# EAGLE schematic sam9g25 (EAGLE 7.2.0)
SAM9G25 Embedded Linux Board Copyright (C) 2015 Andreas Auer (aauer1@emicrotec.at) This program is free software; you can redistribute it and/or modify it under the terms of the GNU General Public License as published by the Free Software Foundation; either version 2 of the License, or (at your option) any later version. This program is distributed in the hope that it will be useful, but WITHOUT ANY WARRANTY; without even the implied warranty of MERCHANTABILITY or FITNESS FOR A PARTICULAR PURPOSE. See the GNU General Public License for more details. You should have received a copy of the GNU General Public License along with this program; if not, write to the Free Software Foundation, Inc., 51 Franklin Street, Fifth Floor, Boston, MA 02110-1301 USA.

## Sheet 1 of 3
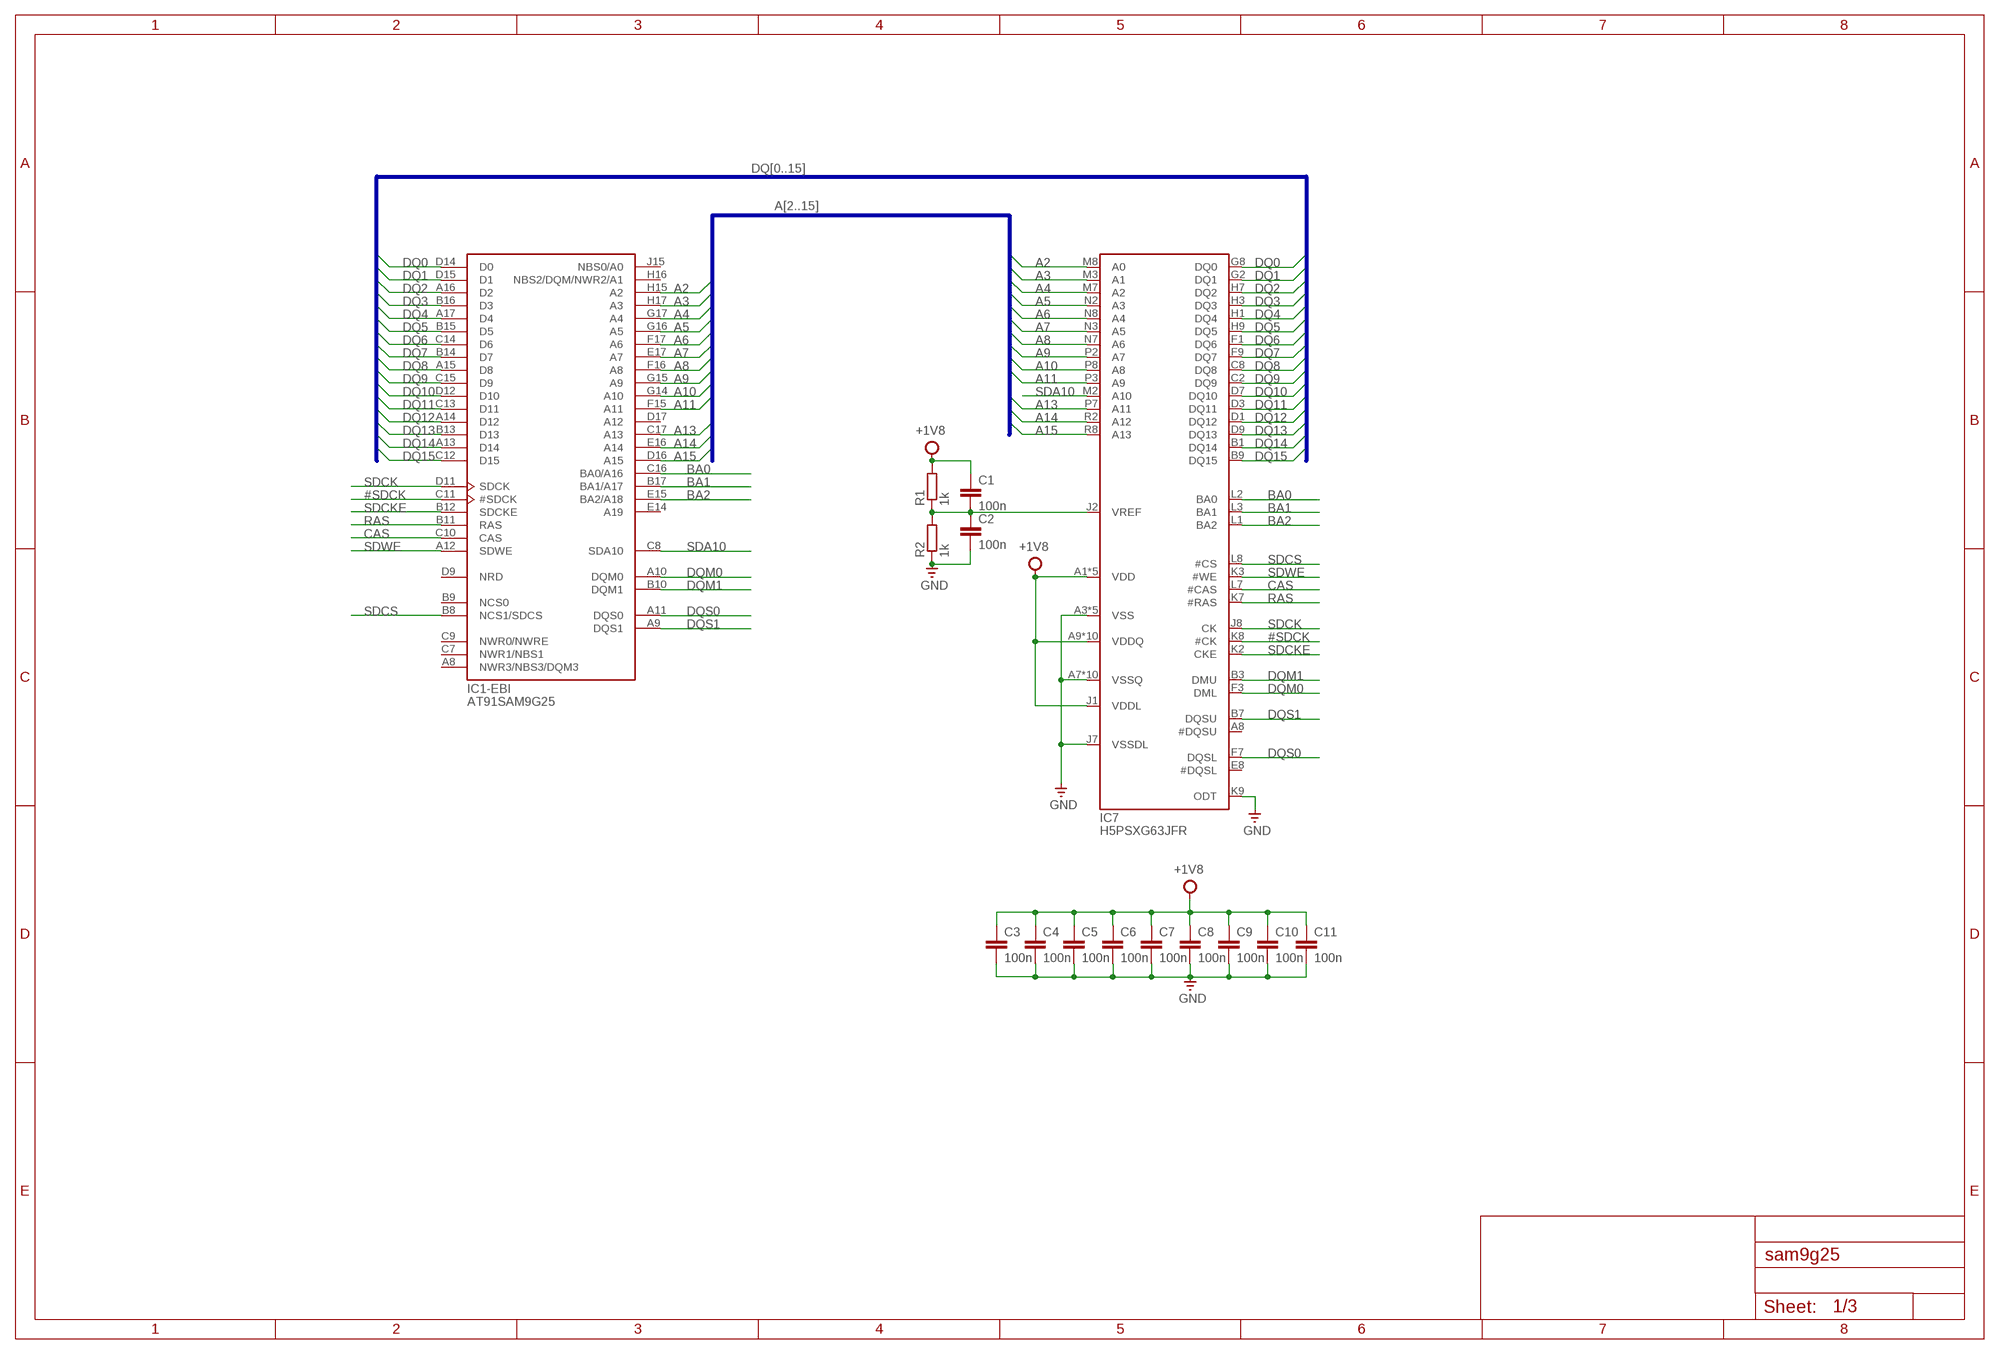
[diagram p0: schematic, sheet 1]

### Parts
C1  100n  C-EUC0603  [C0603]
C2  100n  C-EUC0603  [C0603]
C3  100n  C-EUC0603  [C0603]
C4  100n  C-EUC0603  [C0603]
C5  100n  C-EUC0603  [C0603]
C6  100n  C-EUC0603  [C0603]
C7  100n  C-EUC0603  [C0603]
C8  100n  C-EUC0603  [C0603]
C9  100n  C-EUC0603  [C0603]
C10  100n  C-EUC0603  [C0603]
C11  100n  C-EUC0603  [C0603]
IC1  AT91SAM9G25  [LFBGA217]
IC7  H5PSXG63JFR  [FBGA84]
R1  1k  R-EU_R0603  [R0603]
R2  1k  R-EU_R0603  [R0603]

### Nets
#SDCK: IC1.C11(-EBI:#SDCK) IC7.K8(#CK)
+1V8: C1.1 C3.1 C4.1 C5.1 C6.1 C7.1 C8.1 C9.1 C10.1 C11.1 IC7.A1(VDD) IC7.A9(VDDQ) IC7.C1(VDDQ) IC7.C3(VDDQ) IC7.C7(VDDQ) IC7.C9(VDDQ) IC7.E1(VDD) IC7.E9(VDDQ) IC7.G1(VDDQ) IC7.G3(VDDQ) IC7.G7(VDDQ) IC7.G9(VDDQ) IC7.J1(VDDL) IC7.J9(VDD) IC7.M9(VDD) IC7.R1(VDD) R1.2 ; also sheet 3
A2: IC1.H15(-EBI:A2) IC7.M8(A0)
A3: IC1.H17(-EBI:A3) IC7.M3(A1)
A4: IC1.G17(-EBI:A4) IC7.M7(A2)
A5: IC1.G16(-EBI:A5) IC7.N2(A3)
A6: IC1.F17(-EBI:A6) IC7.N8(A4)
A7: IC1.E17(-EBI:A7) IC7.N3(A5)
A8: IC1.F16(-EBI:A8) IC7.N7(A6)
A9: IC1.G15(-EBI:A9) IC7.P2(A7)
A10: IC1.G14(-EBI:A10) IC7.P8(A8)
A11: IC1.F15(-EBI:A11) IC7.P3(A9)
A13: IC1.C17(-EBI:A13) IC7.P7(A11)
A14: IC1.E16(-EBI:A14) IC7.R2(A12)
A15: IC1.D16(-EBI:A15) IC7.R8(A13)
BA0: IC1.C16(-EBI:BA0/A16) IC7.L2(BA0)
BA1: IC1.B17(-EBI:BA1/A17) IC7.L3(BA1)
BA2: IC1.E15(-EBI:BA2/A18) IC7.L1(BA2)
CAS: IC1.C10(-EBI:CAS) IC7.L7(#CAS)
DQ0: IC1.D14(-EBI:D0) IC7.G8(DQ0)
DQ1: IC1.D15(-EBI:D1) IC7.G2(DQ1)
DQ2: IC1.A16(-EBI:D2) IC7.H7(DQ2)
DQ3: IC1.B16(-EBI:D3) IC7.H3(DQ3)
DQ4: IC1.A17(-EBI:D4) IC7.H1(DQ4)
DQ5: IC1.B15(-EBI:D5) IC7.H9(DQ5)
DQ6: IC1.C14(-EBI:D6) IC7.F1(DQ6)
DQ7: IC1.B14(-EBI:D7) IC7.F9(DQ7)
DQ8: IC1.A15(-EBI:D8) IC7.C8(DQ8)
DQ9: IC1.C15(-EBI:D9) IC7.C2(DQ9)
DQ10: IC1.D12(-EBI:D10) IC7.D7(DQ10)
DQ11: IC1.C13(-EBI:D11) IC7.D3(DQ11)
DQ12: IC1.A14(-EBI:D12) IC7.D1(DQ12)
DQ13: IC1.B13(-EBI:D13) IC7.D9(DQ13)
DQ14: IC1.A13(-EBI:D14) IC7.B1(DQ14)
DQ15: IC1.C12(-EBI:D15) IC7.B9(DQ15)
DQM0: IC1.A10(-EBI:DQM0) IC7.F3(DML)
DQM1: IC1.B10(-EBI:DQM1) IC7.B3(DMU)
DQS0: IC1.A11(-EBI:DQS0) IC7.F7(DQSL)
DQS1: IC1.A9(-EBI:DQS1) IC7.B7(DQSU)
GND: C2.2 C3.2 C4.2 C5.2 C6.2 C7.2 C8.2 C9.2 C10.2 C11.2 IC7.A3(VSS) IC7.A7(VSSQ) IC7.B2(VSSQ) IC7.B8(VSSQ) IC7.D2(VSSQ) IC7.D8(VSSQ) IC7.E3(VSS) IC7.E7(VSSQ) IC7.F2(VSSQ) IC7.F8(VSSQ) IC7.H2(VSSQ) IC7.H8(VSSQ) IC7.J3(VSS) IC7.J7(VSSDL) IC7.K9(ODT) IC7.N1(VSS) IC7.P9(VSS) R2.1 ; also sheet 2,3
N$1: C1.2 C2.1 IC7.J2(VREF) R1.1 R2.2
RAS: IC1.B11(-EBI:RAS) IC7.K7(#RAS)
SDA10: IC1.C8(-EBI:SDA10) IC7.M2(A10)
SDCK: IC1.D11(-EBI:SDCK) IC7.J8(CK)
SDCKE: IC1.B12(-EBI:SDCKE) IC7.K2(CKE)
SDCS: IC1.B8(-EBI:NCS1/SDCS) IC7.L8(#CS)
SDWE: IC1.A12(-EBI:SDWE) IC7.K3(#WE)
Unconnected: IC1.A8(-EBI:NWR3/NBS3/DQM3) IC1.B9(-EBI:NCS0) IC1.C7(-EBI:NWR1/NBS1) IC1.C9(-EBI:NWR0/NWRE) IC1.D9(-EBI:NRD) IC1.D17(-EBI:A12) IC1.E14(-EBI:A19) IC1.H16(-EBI:NBS2/DQM/NWR2/A1) IC1.J15(-EBI:NBS0/A0) IC1.J16(-PORTD:PD21/D31/NCS5) IC1.J17(-PORTD:PD19/D29/NCS2) IC1.K15(-PORTD:PD12/D22) IC1.K16(-PORTD:PD20/D30/NCS4) IC1.K17(-PORTD:PD18/D28/A25) IC1.L14(-PORTD:PD14/D24) IC1.L15(-PORTD:PD17/D27/A24) IC1.L16(-PORTD:PD16/D26/A23) IC1.M14(-PORTD:PD8/D18) IC1.M15(-PORTD:PD13/D23) IC1.M16(-PORTD:PD15/D25/A20) IC1.N14(-PORTD:PD6/D16) IC1.N15(-PORTD:PD11/D21) IC1.N16(-PORTD:PD9/D19) IC1.N17(-PORTD:PD10/D20) IC1.P11(-SMD:DIBP) IC1.P12(-PORTD:PD4/NCS3) IC1.P13(-PORTD:PD0/NANDOE) IC1.P14(-PORTD:PD5/NWAIT) IC1.P15(-PORTD:PD3/A22/NANDCLE) IC1.R11(-SMD:DIBN) IC1.R13(-PORTD:PD2/A21/NANDALE) IC1.R14(-PORTD:PD1/NANDWE) IC1.R15(-PORTD:PD7/D17) IC7.A8(#DQSU) IC7.E8(#DQSL)

### Buses
DQ[0..15]
A[2..15]

## Sheet 2 of 3
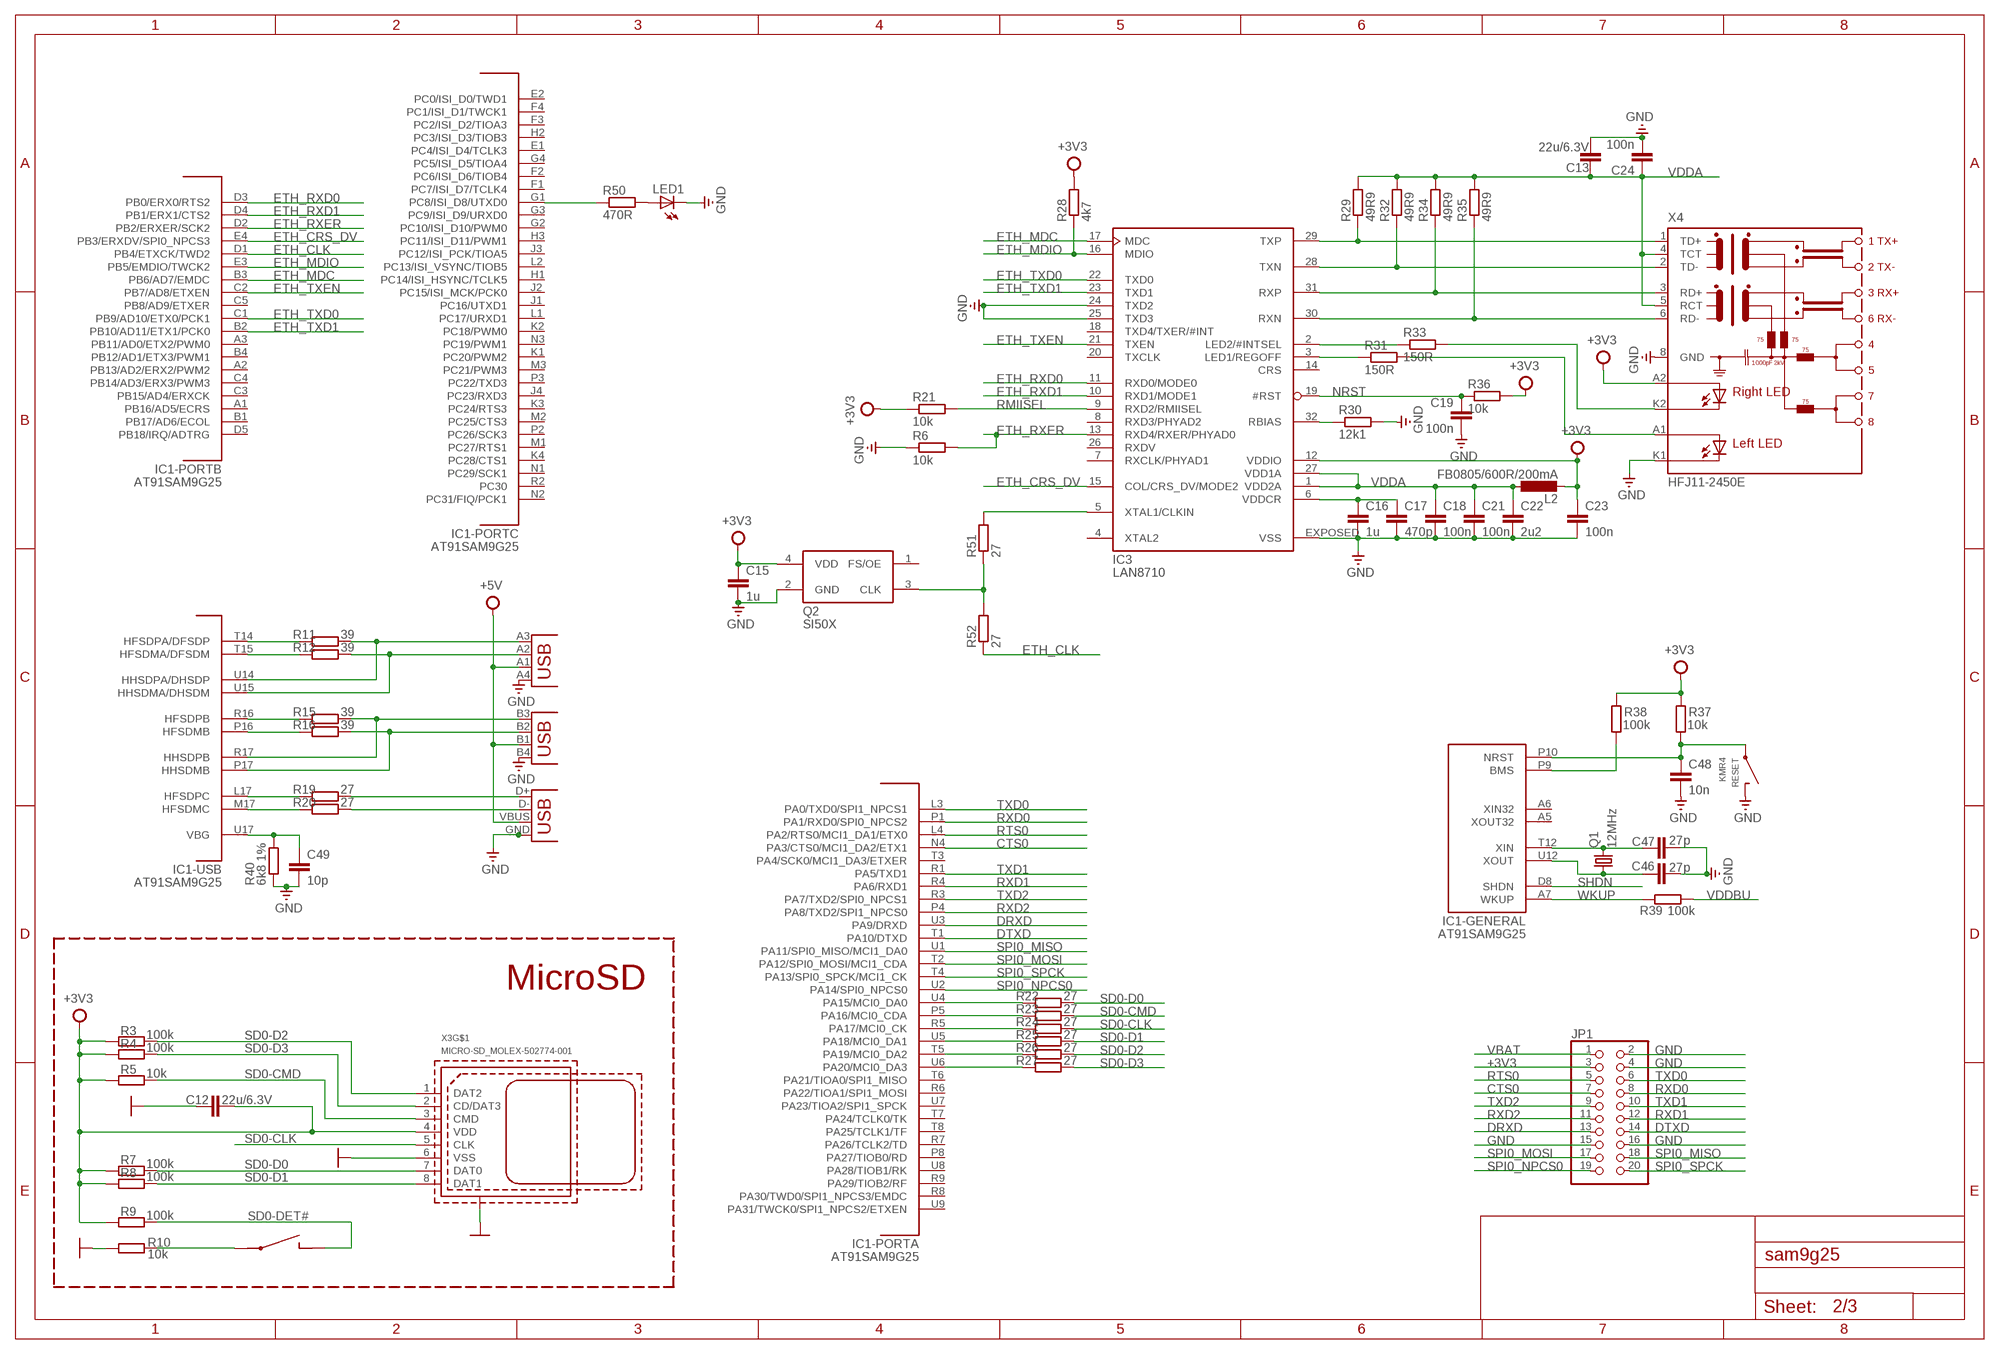
[diagram p1: schematic, sheet 2]

### Parts
C12  22u/6.3V  C-EUC0805  [C0805]
C13  22u/6.3V  C-EUC0805  [C0805]
C15  1u  C-EUC0603  [C0603]
C16  1u  C-EUC0603  [C0603]
C17  470p  C-EUC0603  [C0603]
C18  100n  C-EUC0603  [C0603]
C19  100n  C-EUC0603  [C0603]
C21  100n  C-EUC0603  [C0603]
C22  2u2  C-EUC0603  [C0603]
C23  100n  C-EUC0603  [C0603]
C24  100n  C-EUC0603  [C0603]
C46  27p  C-EUC0603  [C0603]
C47  27p  C-EUC0603  [C0603]
C48  10n  C-EUC0603  [C0603]
C49  10p  C-EUC0603  [C0603]
IC3  LAN8710  [QFN32]
JP1  PINHD-2X10  [2X10]
L2  FB0805/600R/200mA  L-EUL2012C  [L2012C]
LED1  LEDCHIP-LED0603  [CHIP-LED0603]
Q1  12MHz  CRYSTAL-5032  [SMD5032]
Q2  SI50X  [DFN4]
R3  100k  R-EU_R0603  [R0603]
R4  100k  R-EU_R0603  [R0603]
R5  10k  R-EU_R0603  [R0603]
R6  10k  R-EU_R0603  [R0603]
R7  100k  R-EU_R0603  [R0603]
R8  100k  R-EU_R0603  [R0603]
R9  100k  R-EU_R0603  [R0603]
R10  10k  R-EU_R0603  [R0603]
R11  39  R-EU_R0603  [R0603]
R12  39  R-EU_R0603  [R0603]
R15  39  R-EU_R0603  [R0603]
R16  39  R-EU_R0603  [R0603]
R19  27  R-EU_R0603  [R0603]
R20  27  R-EU_R0603  [R0603]
R21  10k  R-EU_R0603  [R0603]
R22  27  R-EU_R0603  [R0603]
R23  27  R-EU_R0603  [R0603]
R24  27  R-EU_R0603  [R0603]
R25  27  R-EU_R0603  [R0603]
R26  27  R-EU_R0603  [R0603]
R27  27  R-EU_R0603  [R0603]
R28  4k7  R-EU_R0603  [R0603]
R29  49R9  R-EU_R0603  [R0603]
R30  12k1  R-EU_R0603  [R0603]
R31  150R  R-EU_R0603  [R0603]
R32  49R9  R-EU_R0603  [R0603]
R33  150R  R-EU_R0603  [R0603]
R34  49R9  R-EU_R0603  [R0603]
R35  49R9  R-EU_R0603  [R0603]
R36  10k  R-EU_R0603  [R0603]
R37  10k  R-EU_R0603  [R0603]
R38  100k  R-EU_R0603  [R0603]
R39  100k  R-EU_R0603  [R0603]
R40  6k8 1%  R-EU_R0603  [R0603]
R50  470R  R-EU_R0603  [R0603]
R51  27  R-EU_R0603  [R0603]
R52  27  R-EU_R0603  [R0603]
RESET  KMR4  [KMR4]
X1  USB-DOUBLE  [USB-DOUBLE-FCI]
X3  MICRO-SD_MOLEX-502774-001  [MOLEX-MICRO-SD]
X4  HFJ11-2450E  [HFJ11_LED]
X5  USB-A-HU  [USB-A-HU]

### Nets
+3V3: C12.2 C15.1 C23.1 IC3.12(VDDIO) JP1.3 L2.2 Q2.4(VDD) R3.2 R4.2 R5.2 R7.2 R8.2 R9.2 R21.1 R28.2 R36.2 R37.2 R38.2 X3.4(VDD) X4.A2(A-R) ; also sheet 3
+5V: X1.A1(-A:VBUS) X1.B1(-B:VBUS) X5.VBUS ; also sheet 3
CTS0: IC1.N4(-PORTA:PA3/CTS0/MCI1_DA2/ETX1) JP1.7
DRXD: IC1.U3(-PORTA:PA9/DRXD) JP1.13
DTXD: IC1.T1(-PORTA:PA10/DTXD) JP1.14
ETH_CLK: IC1.D1(-PORTB:PB4/ETXCK/TWD2) R52.1
ETH_CRS_DV: IC1.E4(-PORTB:PB3/ERXDV/SPI0_NPCS3) IC3.15(COL/CRS_DV/MODE2)
ETH_MDC: IC1.B3(-PORTB:PB6/AD7/EMDC) IC3.17(MDC)
ETH_MDIO: IC1.E3(-PORTB:PB5/EMDIO/TWCK2) IC3.16(MDIO) R28.1
ETH_RXD0: IC1.D3(-PORTB:PB0/ERX0/RTS2) IC3.11(RXD0/MODE0)
ETH_RXD1: IC1.D4(-PORTB:PB1/ERX1/CTS2) IC3.10(RXD1/MODE1)
ETH_RXER: IC1.D2(-PORTB:PB2/ERXER/SCK2) IC3.13(RXD4/RXER/PHYAD0) R6.2
ETH_TXD0: IC1.C1(-PORTB:PB9/AD10/ETX0/PCK1) IC3.22(TXD0)
ETH_TXD1: IC1.B2(-PORTB:PB10/AD11/ETX1/PCK0) IC3.23(TXD1)
ETH_TXEN: IC1.C2(-PORTB:PB7/AD8/ETXEN) IC3.21(TXEN)
GND: C12.1 C13.2 C15.2 C16.2 C17.2 C18.2 C19.2 C21.2 C22.2 C23.2 C24.2 C46.2 C47.2 C48.2 C49.2 IC3.24(TXD2) IC3.25(TXD3) IC3.EXPOSED(VSS) JP1.2 JP1.4 JP1.15 JP1.16 LED1.C Q2.2(GND) R6.1 R10.2 R30.2 R40.1 RESET.2 RESET.4 X1.A4(-A:GND) X1.B4(-B:GND) X3.6(VSS) X3.SHIELD@1 X3.SHIELD@2 X3.SHIELD@3 X3.SHIELD@4 X4.8(GND) X4.K1(C-L) X5.GND ; also sheet 1,3
HFSDMA: IC1.T15(-USB:HFSDMA/DFSDM) R12.1
HFSDMB: IC1.P16(-USB:HFSDMB) R16.1
HFSDMC: IC1.M17(-USB:HFSDMC) R20.1
HFSDPA: IC1.T14(-USB:HFSDPA/DFSDP) R11.1
HFSDPB: IC1.R16(-USB:HFSDPB) R15.1
HFSDPC: IC1.L17(-USB:HFSDPC) R19.1
HHSDMA: IC1.U15(-USB:HHSDMA/DHSDM) R12.2 X1.A2(-A:D-)
HHSDMB: IC1.P17(-USB:HHSDMB) R16.2 X1.B2(-B:D-)
HHSDPA: IC1.U14(-USB:HHSDPA/DHSDP) R11.2 X1.A3(-A:D+)
HHSDPB: IC1.R17(-USB:HHSDPB) R15.2 X1.B3(-B:D+)
N$2: IC3.5(XTAL1/CLKIN) R51.2
N$17: R19.2 X5.D+
N$18: R20.2 X5.D-
N$19: IC1.U6(-PORTA:PA20/MCI0_DA3) R27.1
N$20: IC1.T5(-PORTA:PA19/MCI0_DA2) R26.1
N$21: IC1.U5(-PORTA:PA18/MCI0_DA1) R25.1
N$22: IC1.R5(-PORTA:PA17/MCI0_CK) R24.1
N$23: IC1.P5(-PORTA:PA16/MCI0_CDA) R23.1
N$24: IC1.U4(-PORTA:PA15/MCI0_DA0) R22.1
N$25: C49.1 IC1.U17(-USB:VBG) R40.2
N$26: C46.1 IC1.U12(-GENERAL:XOUT) Q1.1
N$27: C47.1 IC1.T12(-GENERAL:XIN) Q1.2
N$28: IC1.P9(-GENERAL:BMS) R38.1
N$29: IC3.32(RBIAS) R30.1
N$30: C16.1 C17.1 IC3.6(VDDCR)
N$31: IC1.G1(-PORTC:PC8/ISI_D8/UTXD0) R50.1
N$45: LED1.A R50.2
N$46: Q2.3(CLK) R51.1 R52.2
N$58: R10.1 X3.SW1
N$101: IC3.2(LED2/#INTSEL) R33.1
N$106: IC3.3(LED1/REGOFF) R31.1
N$107: IC3.30(RXN) R35.1 X4.6(RD-)
N$108: IC3.31(RXP) R34.1 X4.3(RD+)
N$110: IC3.29(TXP) R29.1 X4.1(TD+)
N$111: R33.2 X4.K2(C-R)
N$112: R31.2 X4.A1(A-L)
N$114: IC3.28(TXN) R32.1 X4.2(TD-)
NRST: C19.1 C48.1 IC1.P10(-GENERAL:NRST) IC3.19(#RST) R36.1 R37.1 RESET.1 RESET.3
RMIISEL: IC3.9(RXD2/RMIISEL) R21.2
RTS0: IC1.L4(-PORTA:PA2/RTS0/MCI1_DA1/ETX0) JP1.5
RXD0: IC1.P1(-PORTA:PA1/RXD0/SPI0_NPCS2) JP1.8
RXD1: IC1.R4(-PORTA:PA6/RXD1) JP1.12
RXD2: IC1.P4(-PORTA:PA8/TXD2/SPI1_NPCS0) JP1.11
SD0-CLK: R24.2 X3.5(CLK)
SD0-CMD: R5.1 R23.2 X3.3(CMD)
SD0-D0: R7.1 R22.2 X3.7(DAT0)
SD0-D1: R8.1 R25.2 X3.8(DAT1)
SD0-D2: R3.1 R26.2 X3.1(DAT2)
SD0-D3: R4.1 R27.2 X3.2(CD/DAT3)
SD0-DET#: R9.1 X3.SW2
SHDN: IC1.D8(-GENERAL:SHDN)
SPI0_MISO: IC1.U1(-PORTA:PA11/SPI0_MISO/MCI1_DA0) JP1.18
SPI0_MOSI: IC1.T2(-PORTA:PA12/SPI0_MOSI/MCI1_CDA) JP1.17
SPI0_NPCS0: IC1.U2(-PORTA:PA14/SPI0_NPCS0) JP1.19
SPI0_SPCK: IC1.T4(-PORTA:PA13/SPI0_SPCK/MCI1_CK) JP1.20
TXD0: IC1.L3(-PORTA:PA0/TXD0/SPI1_NPCS1) JP1.6
TXD1: IC1.R1(-PORTA:PA5/TXD1) JP1.10
TXD2: IC1.R3(-PORTA:PA7/TXD2/SPI0_NPCS1) JP1.9
VBAT: JP1.1 ; also sheet 3
VDDA: C13.1 C18.1 C21.1 C22.1 C24.1 IC3.1(VDD2A) IC3.27(VDD1A) L2.1 R29.2 R32.2 R34.2 R35.2 X4.4(TCT) X4.5(RCT)
VDDBU: R39.1 ; also sheet 3
WKUP: IC1.A7(-GENERAL:WKUP) R39.2
Unconnected: IC1.A1(-PORTB:PB16/AD5/ECRS) IC1.A2(-PORTB:PB13/AD2/ERX2/PWM2) IC1.A3(-PORTB:PB11/AD0/ETX2/PWM0) IC1.A5(-GENERAL:XOUT32) IC1.A6(-GENERAL:XIN32) IC1.B1(-PORTB:PB17/AD6/ECOL) IC1.B4(-PORTB:PB12/AD1/ETX3/PWM1) IC1.C3(-PORTB:PB15/AD4/ERXCK) IC1.C4(-PORTB:PB14/AD3/ERX3/PWM3) IC1.C5(-PORTB:PB8/AD9/ETXER) IC1.D5(-PORTB:PB18/IRQ/ADTRG) IC1.E1(-PORTC:PC4/ISI_D4/TCLK3) IC1.E2(-PORTC:PC0/ISI_D0/TWD1) IC1.F1(-PORTC:PC7/ISI_D7/TCLK4) IC1.F2(-PORTC:PC6/ISI_D6/TIOB4) IC1.F3(-PORTC:PC2/ISI_D2/TIOA3) IC1.F4(-PORTC:PC1/ISI_D1/TWCK1) IC1.G2(-PORTC:PC10/ISI_D10/PWM0) IC1.G3(-PORTC:PC9/ISI_D9/URXD0) IC1.G4(-PORTC:PC5/ISI_D5/TIOA4) IC1.H1(-PORTC:PC14/ISI_HSYNC/TCLK5) IC1.H2(-PORTC:PC3/ISI_D3/TIOB3) IC1.H3(-PORTC:PC11/ISI_D11/PWM1) IC1.J1(-PORTC:PC16/UTXD1) IC1.J2(-PORTC:PC15/ISI_MCK/PCK0) IC1.J3(-PORTC:PC12/ISI_PCK/TIOA5) IC1.J4(-PORTC:PC23/RXD3) IC1.K1(-PORTC:PC20/PWM2) IC1.K2(-PORTC:PC18/PWM0) IC1.K3(-PORTC:PC24/RTS3) IC1.K4(-PORTC:PC28/CTS1) IC1.L1(-PORTC:PC17/URXD1) IC1.L2(-PORTC:PC13/ISI_VSYNC/TIOB5) IC1.M1(-PORTC:PC27/RTS1) IC1.M2(-PORTC:PC25/CTS3) IC1.M3(-PORTC:PC21/PWM3) IC1.N1(-PORTC:PC29/SCK1) IC1.N2(-PORTC:PC31/FIQ/PCK1) IC1.N3(-PORTC:PC19/PWM1) IC1.P2(-PORTC:PC26/SCK3) IC1.P3(-PORTC:PC22/TXD3) IC1.P8(-PORTA:PA27/TIOB0/RD) IC1.R2(-PORTC:PC30) IC1.R6(-PORTA:PA22/TIOA1/SPI1_MOSI) IC1.R7(-PORTA:PA26/TCLK2/TD) IC1.R8(-PORTA:PA30/TWD0/SPI1_NPCS3/EMDC) IC1.R9(-PORTA:PA29/TIOB2/RF) IC1.T3(-PORTA:PA4/SCK0/MCI1_DA3/ETXER) IC1.T6(-PORTA:PA21/TIOA0/SPI1_MISO) IC1.T7(-PORTA:PA24/TCLK0/TK) IC1.T8(-PORTA:PA25/TCLK1/TF) IC1.U7(-PORTA:PA23/TIOA2/SPI1_SPCK) IC1.U8(-PORTA:PA28/TIOB1/RK) IC1.U9(-PORTA:PA31/TWCK0/SPI1_NPCS2/ETXEN) IC3.4(XTAL2) IC3.7(RXCLK/PHYAD1) IC3.8(RXD3/PHYAD2) IC3.14(CRS) IC3.18(TXD4/TXER/#INT) IC3.20(TXCLK) IC3.26(RXDV) Q2.1(FS/OE) X1.P$1 X1.P$2 X1.P$3 X1.P$4

### Notes on the sheet
- default PHYAD = 3'b000
- MicroSD

## Sheet 3 of 3
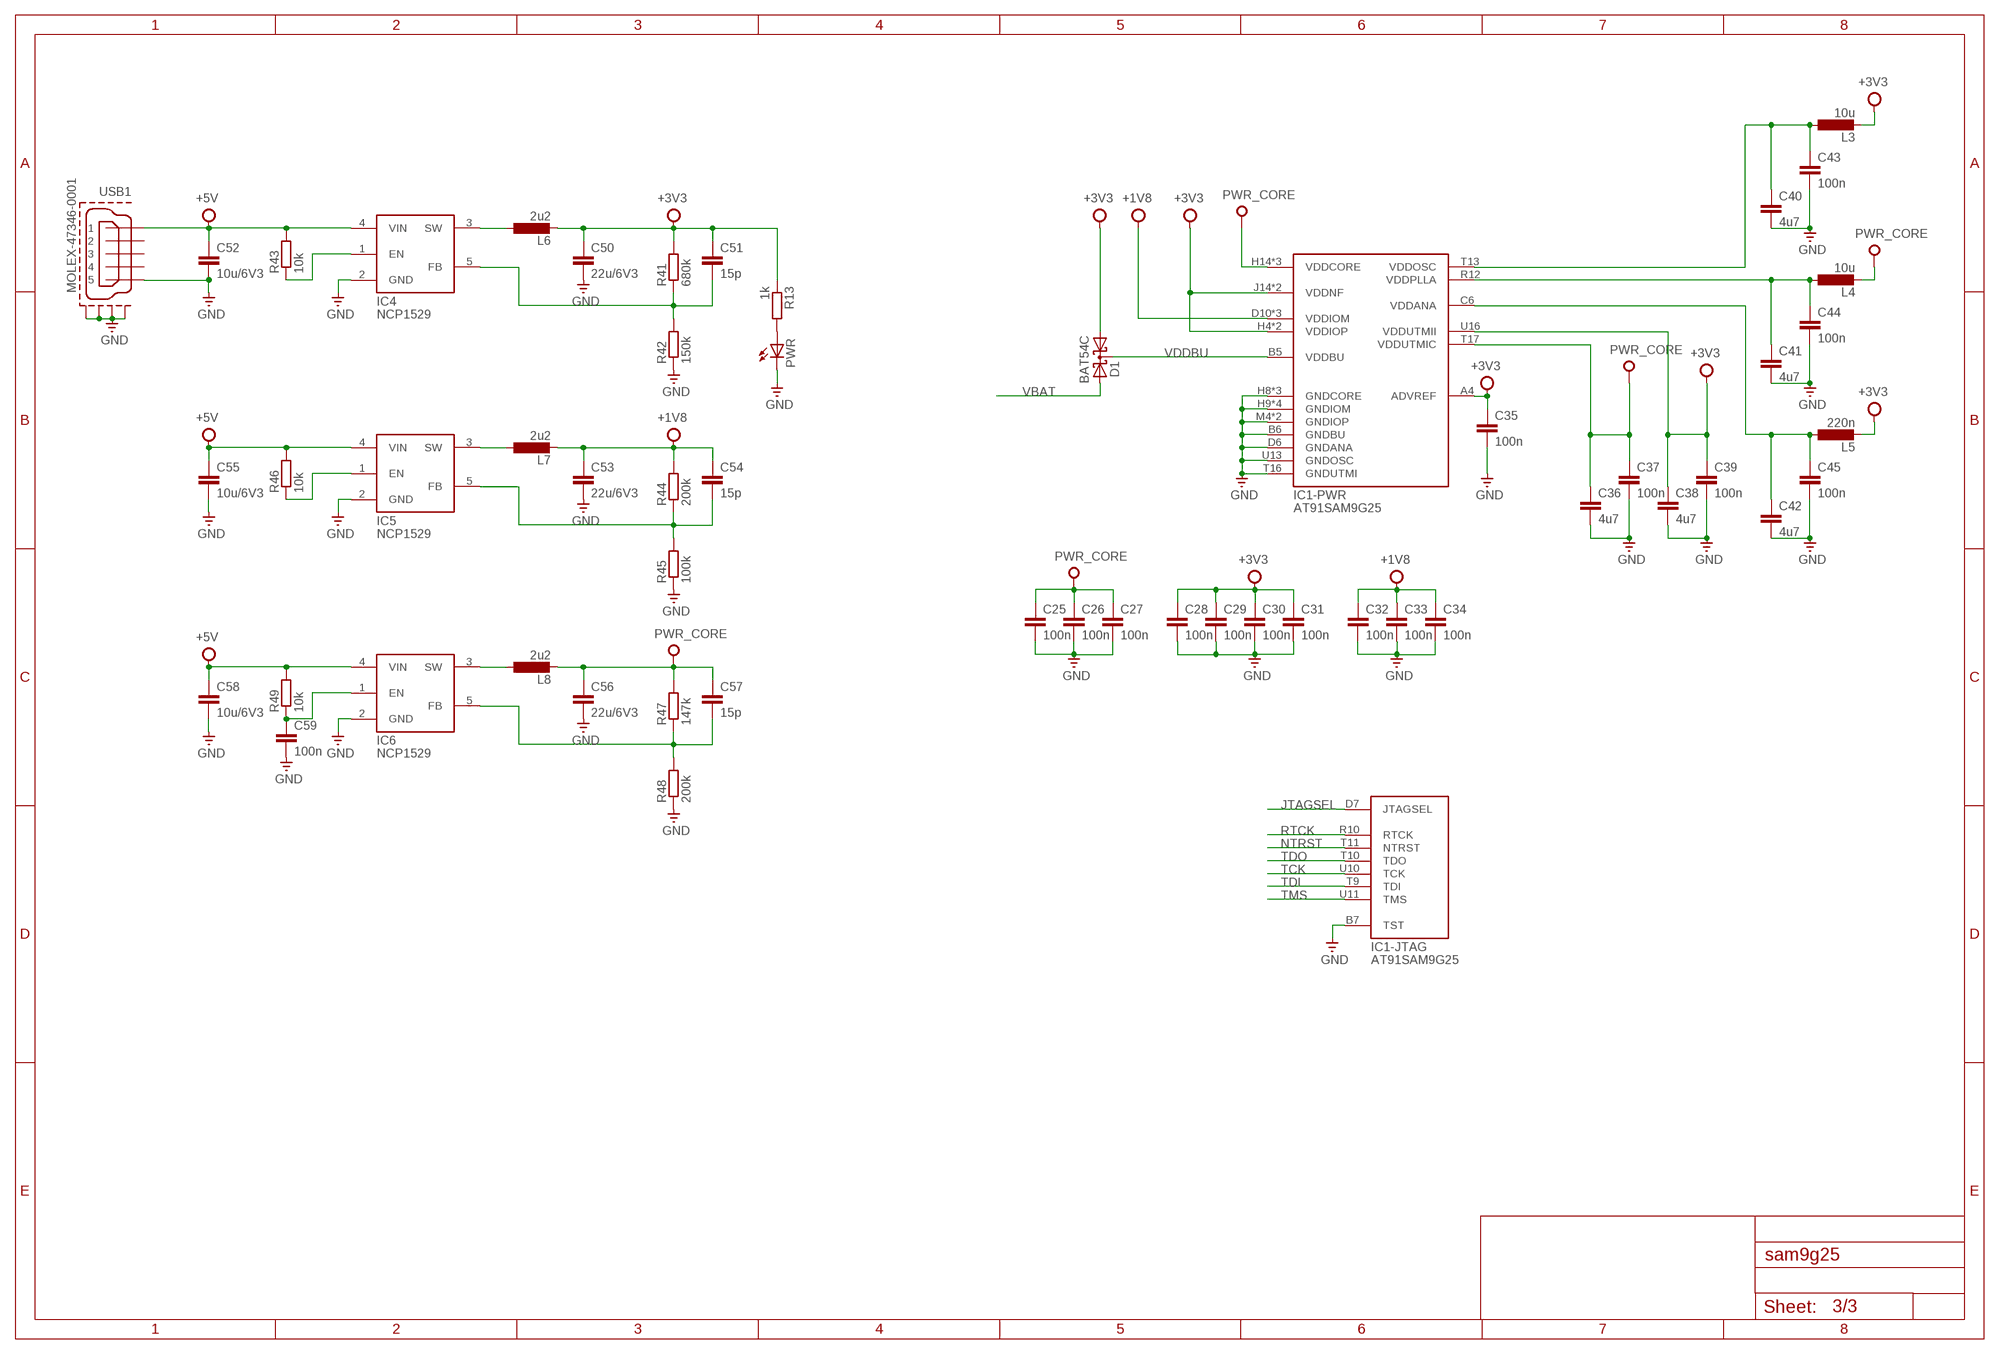
[diagram p2: schematic, sheet 3]

### Parts
C25  100n  C-EUC0603  [C0603]
C26  100n  C-EUC0603  [C0603]
C27  100n  C-EUC0603  [C0603]
C28  100n  C-EUC0603  [C0603]
C29  100n  C-EUC0603  [C0603]
C30  100n  C-EUC0603  [C0603]
C31  100n  C-EUC0603  [C0603]
C32  100n  C-EUC0603  [C0603]
C33  100n  C-EUC0603  [C0603]
C34  100n  C-EUC0603  [C0603]
C35  100n  C-EUC0603  [C0603]
C36  4u7  C-EUC0603  [C0603]
C37  100n  C-EUC0603  [C0603]
C38  4u7  C-EUC0603  [C0603]
C39  100n  C-EUC0603  [C0603]
C40  4u7  C-EUC0603  [C0603]
C41  4u7  C-EUC0603  [C0603]
C42  4u7  C-EUC0603  [C0603]
C43  100n  C-EUC0603  [C0603]
C44  100n  C-EUC0603  [C0603]
C45  100n  C-EUC0603  [C0603]
C50  22u/6V3  C-EUC0805  [C0805]
C51  15p  C-EUC0603  [C0603]
C52  10u/6V3  C-EUC0805  [C0805]
C53  22u/6V3  C-EUC0805  [C0805]
C54  15p  C-EUC0603  [C0603]
C55  10u/6V3  C-EUC0805  [C0805]
C56  22u/6V3  C-EUC0805  [C0805]
C57  15p  C-EUC0603  [C0603]
C58  10u/6V3  C-EUC0805  [C0805]
C59  100n  C-EUC0603  [C0603]
D1  BAT54C  [SOT23]
IC4  NCP1529  [SOT23-5]
IC5  NCP1529  [SOT23-5]
IC6  NCP1529  [SOT23-5]
L3  10u  L-EUL2012C  [L2012C]
L4  10u  L-EUL2012C  [L2012C]
L5  220n  L-EUL2012C  [L2012C]
L6  2u2  L-EUL3230M  [L3230M]
L7  2u2  L-EUL3230M  [L3230M]
L8  2u2  L-EUL3230M  [L3230M]
PWR  LEDCHIP-LED0603  [CHIP-LED0603]
R13  1k  R-EU_R0603  [R0603]
R41  680k  R-EU_R0603  [R0603]
R42  150k  R-EU_R0603  [R0603]
R43  10k  R-EU_R0603  [R0603]
R44  200k  R-EU_R0603  [R0603]
R45  100k  R-EU_R0603  [R0603]
R46  10k  R-EU_R0603  [R0603]
R47  147k  R-EU_R0603  [R0603]
R48  200k  R-EU_R0603  [R0603]
R49  10k  R-EU_R0603  [R0603]
USB1  MOLEX-47346-0001  [MOLEX-47364-0001]

### Nets
+1V8: C32.1 C33.1 C34.1 C53.1 C54.1 IC1.D10(-PWR:VDDIOM) IC1.D13(-PWR:VDDIOM) IC1.F14(-PWR:VDDIOM) L7.2 R44.2 ; also sheet 1
+3V3: C28.1 C29.1 C30.1 C31.1 C35.1 C38.1 C39.1 C50.1 C51.1 D1.1(A1) IC1.A4(-PWR:ADVREF) IC1.H4(-PWR:VDDIOP) IC1.J14(-PWR:VDDNF) IC1.K14(-PWR:VDDNF) IC1.P7(-PWR:VDDIOP) IC1.U16(-PWR:VDDUTMII) L3.2 L5.2 L6.2 R13.1 R41.2 ; also sheet 2
+5V: C52.1 C55.1 C58.1 IC4.4(VIN) IC5.4(VIN) IC6.4(VIN) R43.2 R46.2 R49.2 USB1.1 ; also sheet 2
GND: C25.2 C26.2 C27.2 C28.2 C29.2 C30.2 C31.2 C32.2 C33.2 C34.2 C35.2 C36.2 C37.2 C38.2 C39.2 C40.2 C41.2 C42.2 C43.2 C44.2 C45.2 C50.2 C52.2 C53.2 C55.2 C56.2 C58.2 C59.2 IC1.B6(-PWR:GNDBU) IC1.B7(-JTAG:TST) IC1.D6(-PWR:GNDANA) IC1.H8(-PWR:GNDCORE) IC1.H9(-PWR:GNDIOM) IC1.H10(-PWR:GNDIOM) IC1.J8(-PWR:GNDCORE) IC1.J9(-PWR:GNDIOM) IC1.J10(-PWR:GNDIOM) IC1.K10(-PWR:GNDCORE) IC1.M4(-PWR:GNDIOP) IC1.P6(-PWR:GNDIOP) IC1.T16(-PWR:GNDUTMI) IC1.U13(-PWR:GNDOSC) IC4.2(GND) IC5.2(GND) IC6.2(GND) PWR.C R42.1 R45.1 R48.1 USB1.5 USB1.GND1 USB1.GND2 USB1.GND3 USB1.GND4 ; also sheet 1,2
JTAGSEL: IC1.D7(-JTAG:JTAGSEL)
N$4: PWR.A R13.2
N$32: IC4.3(SW) L6.1
N$33: IC5.3(SW) L7.1
N$35: C51.2 IC4.5(FB) R41.1 R42.2
N$36: C54.2 IC5.5(FB) R44.1 R45.2
N$37: IC4.1(EN) R43.1
N$38: IC5.1(EN) R46.1
N$39: IC6.3(SW) L8.1
N$40: C57.2 IC6.5(FB) R47.1 R48.2
N$41: C59.1 IC6.1(EN) R49.1
NTRST: IC1.T11(-JTAG:NTRST)
PWR_CORE: C25.1 C26.1 C27.1 C36.1 C37.1 C56.1 C57.1 IC1.H14(-PWR:VDDCORE) IC1.K8(-PWR:VDDCORE) IC1.K9(-PWR:VDDCORE) IC1.T17(-PWR:VDDUTMIC) L4.2 L8.2 R47.2
RTCK: IC1.R10(-JTAG:RTCK)
TCK: IC1.U10(-JTAG:TCK)
TDI: IC1.T9(-JTAG:TDI)
TDO: IC1.T10(-JTAG:TDO)
TMS: IC1.U11(-JTAG:TMS)
VBAT: D1.2(A2) ; also sheet 2
VDDANA: C42.1 C45.1 IC1.C6(-PWR:VDDANA) L5.1
VDDBU: D1.3(CC) IC1.B5(-PWR:VDDBU) ; also sheet 2
VDDOSC: C40.1 C43.1 IC1.T13(-PWR:VDDOSC) L3.1
VDDPLLA: C41.1 C44.1 IC1.R12(-PWR:VDDPLLA) L4.1
Unconnected: USB1.2 USB1.3 USB1.4

## Library data of the parts
C1-C11 C18 C19 C21 C23-C35 C37 C39 C43-C45 C59 = rcl:C-EU: CAPACITOR, European symbol; MF: MULTICOMP; MPN: MC0603B104K250CT; OC_FARNELL: 1759037
C12 C13 = rcl:C-EU: CAPACITOR, European symbol; MF: TDK; MPN: C2012X5R0J226M/1.25; OC_FARNELL: 2309030
C15 C46 C47 = rcl:C-EU: CAPACITOR, European symbol; MF: MULTICOMP; MPN: MC0603N270J500CT; OC_FARNELL: 1759058
C16 = rcl:C-EU: CAPACITOR, European symbol; MF: MULTICOMP; MPN: MC0603X105K100CT; OC_FARNELL: 1759399
C17 = rcl:C-EU: CAPACITOR, European symbol; MF: MULTICOMP; MPN: MC0603B471K500CT; OC_FARNELL: 1759079
C22 = rcl:C-EU: CAPACITOR, European symbol; MF: MULTICOMP; MPN: MC0603X225K6R3CT; OC_FARNELL: 1759392
C36 C38 C40-C42 = rcl:C-EU: CAPACITOR, European symbol; MF: MULTICOMP; MPN: MC0603X475K6R3CT; OC_FARNELL: 2320811
C48 = rcl:C-EU: CAPACITOR, European symbol; MF: MULTICOMP; MPN: MC0603B103K160CT; OC_FARNELL: 1759003
C49 = rcl:C-EU: CAPACITOR, European symbol; MF: MULTICOMP; MPN: MC0603N100J500CT; OC_FARNELL: 2320799
C50 C52 C53 C55 C56 C58 = rcl:C-EU: CAPACITOR, European symbol; MF: MULTICOMP; MPN: MC0805X106K6R3CT; OC_FARNELL: 2320852
C51 C54 C57 = rcl:C-EU: CAPACITOR, European symbol; MF: MULTICOMP; MPN: MC0603N150J500CT; OC_FARNELL: 1759055
D1 = diode:BAT54C: Schottky Diodes Source: Fairchild .. BAT54.pdf; MF: FAIRCHILD SEMICONDUCTOR; MPN: BAT54C; OC_FARNELL: 1081192
IC1 = mystuff:AT91SAM9G25; MF: ATMEL; MPN: AT91SAM9G25-CU; OC_FARNELL: 2066288
IC3 = myrf:LAN8710; MF: MICROCHIP; MPN: LAN8710A-EZK; OC_FARNELL: 2292575
IC4-IC6 = mystuff:NCP1529: On Semiconductor DC DC step down converter; MF: ON SEMICONDUCTOR; MPN: NCP1529ASNT1G; OC_FARNELL: 2112613
IC7 = mystuff:H5PSXG63JFR; MF: HYNIX SEMICONDUCTOR; MPN: H5PS1G63JFR-S5C; OC_FARNELL: 2114749
JP1 = pinhead:PINHD-2X10: PIN HEADER; OC_FARNELL: unknown
L2 = rcl:L-EU: INDUCTOR, European symbol; MF: MURATA; MPN: BLM21BD601SN1D; OC_FARNELL: 1515655
L3 L4 = rcl:L-EU: INDUCTOR, European symbol; MF: TAIYO YUDEN; MPN: CB2012T100MR.; OC_FARNELL: 2112890
L5 = rcl:L-EU: INDUCTOR, European symbol; MF: TDK; MPN: MLZ2012DR22DT; OC_FARNELL: 2215646
L6-L8 = rcl:L-EU: INDUCTOR, European symbol; MF: COILCRAFT; MPN: ME3220-222MLB; OC_FARNELL: 2287940
LED1 PWR = led:LED: LED OSRAM: - CHIPLED LG R971, LG N971, LY N971, LG Q971, LY Q971, LO R971, LY R971 LH N974, LH R974 LS Q976, LO Q976, LY Q976 LO Q996 - Hyper CHIPLED LW Q18S LB Q993, LB Q99A, LB R99A - SideLED LS A670, LO A670, LY A670, LG A670, LP A670 LB A673, LV A673, LT A673, LW A673 LH A674 LY A675 LS A676, LA A676, LO A676, LY A676, LW A676 LS A679, LY A679, LG A679 - Hyper Micro SIDELED® LS Y876, LA Y876, LO Y876, LY Y876 LT Y87S - SmartLED LW L88C, LW L88S LB L89C, LB L89S, LG L890 LS L89K, LO L89K, LY L89K LS L896, LA L896, LO L896, LY L896 - TOPLED LS T670, LO T670, LY T670, LG T670, LP T670 LSG T670, LSP T670, LSY T670, LOP T670, LYG T670 LG T671, LOG T671, LSG T671 LB T673, LV T673, LT T673, LW T673 LH T674 LS T676, LA T676, LO T676, LY T676, LB T676, LH T676, LSB T676, LW T676 LB T67C, LV T67C, LT T67C, LS T67K, LO T67K, LY T67K, LW E67C LS E67B, LA E67B, LO E67B, LY E67B, LB E67C, LV E67C, LT E67C LW T67C LS T679, LY T679, LG T679 LS T770, LO T770, LY T770, LG T770, LP T770 LB T773, LV T773, LT T773, LW T773 LH T774 LS E675, LA E675, LY E675, LS T675 LS T776, LA T776, LO T776, LY T776, LB T776 LHGB T686 LT T68C, LB T68C - Hyper Mini TOPLED® LB M676 - Mini TOPLED Santana® LG M470 LS M47K, LO M47K, LY M47K Source: http://www.osram.convergy.de LUXEON: - LUMILED® LXK2-PW12-R00, LXK2-PW12-S00, LXK2-PW14-U00, LXK2-PW14-V00 LXK2-PM12-R00, LXK2-PM12-S00, LXK2-PM14-U00 LXK2-PE12-Q00, LXK2-PE12-R00, LXK2-PE12-S00, LXK2-PE14-T00, LXK2-PE14-U00 LXK2-PB12-K00, LXK2-PB12-L00, LXK2-PB12-M00, LXK2-PB14-N00, LXK2-PB14-P00, LXK2-PB14-Q00 LXK2-PR12-L00, LXK2-PR12-M00, LXK2-PR14-Q00, LXK2-PR14-R00 LXK2-PD12-Q00, LXK2-PD12-R00, LXK2-PD12-S00 LXK2-PH12-R00, LXK2-PH12-S00 LXK2-PL12-P00, LXK2-PL12-Q00, LXK2-PL12-R00 Source: www.luxeon.com KINGBRIGHT: KA-3528ASYC Source: www.kingbright.com; MF: KINGBRIGHT; MPN: KP-1608SURCK; OC_FARNELL: 2290329
Q1 = mystuff:CRYSTAL; MF: TXC; MPN: 7A-12.000MAAJ-T; OC_FARNELL: 1841940
Q2 = myrf:SI50X
R1 R2 = rcl:R-EU_: RESISTOR, European symbol; MF: MULTICOMP; MPN: MC0063W060351K5; OC_FARNELL: 9331808
R3 R4 R7-R9 R38 R39 R45 = rcl:R-EU_: RESISTOR, European symbol; MF: MULTICOMP; MPN: MC0063W06035100K; OC_FARNELL: 9331719
R5 R6 R10 R21 R37 R43 R46 R49 R51 R52 = rcl:R-EU_: RESISTOR, European symbol; MF: YAGEO (PHYCOMP); MPN: RC0603FR-0710KL; OC_FARNELL: 9238603
R11 R12 R15 R16 = rcl:R-EU_: RESISTOR, European symbol; MF: VISHAY DRALORIC; MPN: CRCW060339R0FKEA; OC_FARNELL: 2141230
R13 R50 = rcl:R-EU_: RESISTOR, European symbol; MF: MULTICOMP; MPN: MCMR06X1001FTL; OC_FARNELL: 2073348
R19 R20 R22-R27 = rcl:R-EU_: RESISTOR, European symbol; MF: MULTICOMP; MPN: MC0063W0603527R; OC_FARNELL: 9331956
R28 = rcl:R-EU_: RESISTOR, European symbol; MF: MULTICOMP; MPN: MC0063W060354K7; OC_FARNELL: 9332154
R29 R32 R34 R35 = rcl:R-EU_: RESISTOR, European symbol; MF: PANASONIC; MPN: ERJ3GEYJ510V; OC_FARNELL: 2059567
R30 R36 = rcl:R-EU_: RESISTOR, European symbol; MF: PANASONIC; MPN: ERJ3EKF1212V; OC_FARNELL: 2059413
R31 R33 = rcl:R-EU_: RESISTOR, European symbol; MF: MULTICOMP; MPN: MC0063W06035150R; OC_FARNELL: 9331794
R40 = rcl:R-EU_: RESISTOR, European symbol; MF: MULTICOMP; MPN: MCMR06X6801FTL; OC_FARNELL: 2073558
R41 = rcl:R-EU_: RESISTOR, European symbol; MF: VISHAY DRALORIC; MPN: CRCW0603680KFKEA; OC_FARNELL: 2138587
R42 = rcl:R-EU_: RESISTOR, European symbol; MF: PANASONIC; MPN: ERJ3GEYJ154V; OC_FARNELL: 2059659
R44 R48 = rcl:R-EU_: RESISTOR, European symbol; MF: PANASONIC; MPN: ERJ3EKF2003V; OC_FARNELL: 2059509
R47 = rcl:R-EU_: RESISTOR, European symbol; MF: VISHAY DRALORIC; MPN: CRCW0603147KFKEA; OC_FARNELL: 2138514
RESET = smartdeskphone:KMR4; MF: C & K COMPONENTS; MPN: KMR421NGULCLFS; OC_FARNELL: 1908237
USB1 = usb_con-update:MOLEX-47346-0001: MICRO USB B, BOTTOM MOUNT; MF: MOLEX; MPN: 47346-0001; OC_FARNELL: 1568026
X1 = mystuff:USB-DOUBLE; MF: FCI; MPN: 72309-8034BLF; OC_FARNELL: 1097895
X3 = smartdeskphone:MICRO-SD; MF: MOLEX; MPN: 502774-0891; OC_FARNELL: 2064063
X4 = mystuff:HFJ11-2450E; OC_FARNELL: unknown
X5 = mycon:USB: USB Connectors